# EAGLE design MainBoard (EAGLE 9.1.0)

## Sheet 1 of 3: Logic
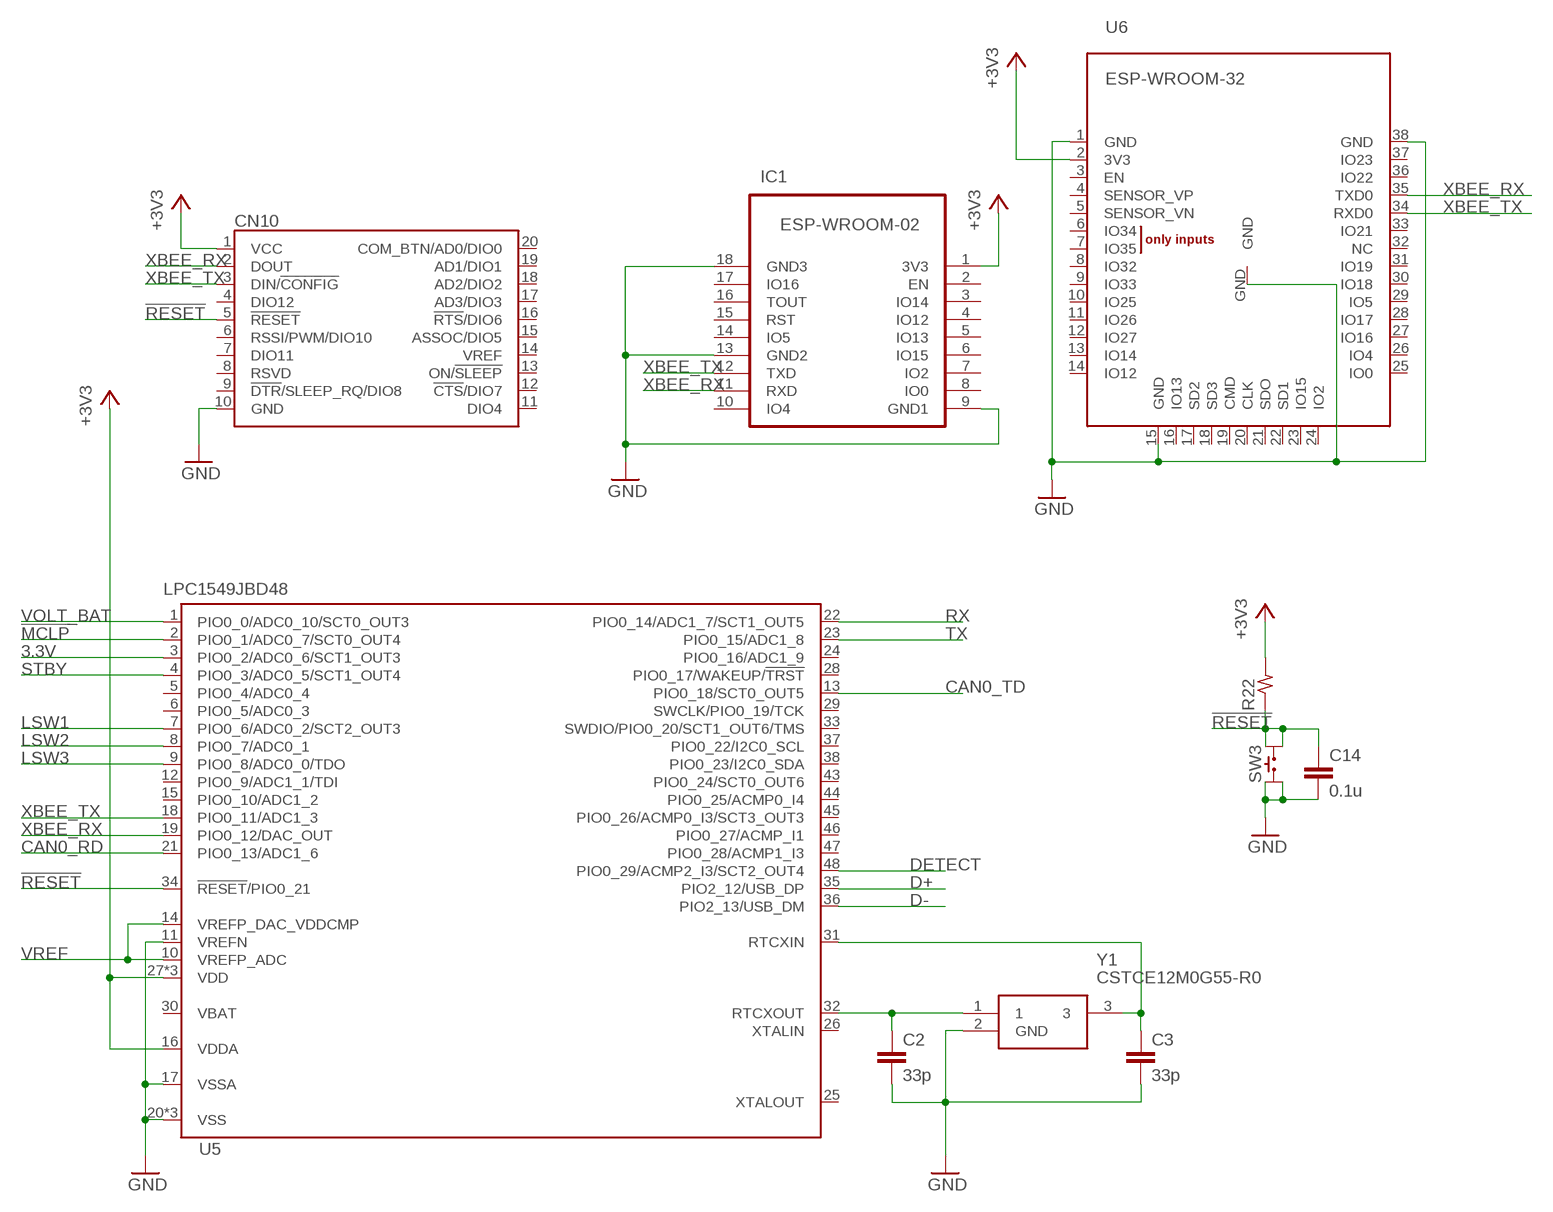
[diagram p0: schematic, sheet 1]

### Parts
C2  33p  C1608  [C1608]
C3  33p  C1608  [C1608]
C14  0.1u  C1608  [C1608]
CN10  XBEE-TH  [XBEE-TH]
IC1  ESP-WROOM-02  [ESP-WROOM-02]
R22  R1608  [R1608]
SW3  SKRP  [SKRP]
U5  LPC1549JBD48  [SOT313-2]
U6  ESP-WROOM-32  [ESP-WROOM-32]
Y1  CSTCE12M0G55-R0  [CSTCE12M0G55-R0]

### Nets
3.3V: U5.3(PIO0_2/ADC0_6/SCT1_OUT3)
!MCLP: U5.2(PIO0_1/ADC0_7/SCT0_OUT4) ; also sheet 3
!RESET: C14.1 CN10.5(!RESET) R22.1 SW3.B1 SW3.B2 U5.34(!RESET!/PIO0_21)
+3V3: CN10.1(VCC) IC1.1(3V3) R22.2 U5.16(VDDA) U5.27(VDD) U5.39(VDD) U5.42(VDD) U6.2(3V3) ; also sheet 2,3
CAN0_RD: U5.21(PIO0_13/ADC1_6) ; also sheet 3
CAN0_TD: U5.13(PIO0_18/SCT0_OUT5) ; also sheet 3
D+: U5.35(PIO2_12/USB_DP) ; also sheet 3
D-: U5.36(PIO2_13/USB_DM) ; also sheet 3
DETECT: U5.48(PIO0_29/ACMP2_I3/SCT2_OUT4) ; also sheet 3
GND: C2.2 C3.2 C14.2 CN10.10(GND) IC1.8(IO0) IC1.9(GND1) IC1.13(GND2) IC1.18(GND3) IC1.19(GND0) SW3.A1 SW3.A2 U5.11(VREFN) U5.17(VSSA) U5.20(VSS) U5.40(VSS) U5.41(VSS) U6.1(GND) U6.15(GND) U6.38(GND) U6.GND Y1.2(GND) ; also sheet 2,3
LSW1: U5.7(PIO0_6/ADC0_2/SCT2_OUT3) ; also sheet 2
LSW2: U5.8(PIO0_7/ADC0_1) ; also sheet 2
LSW3: U5.9(PIO0_8/ADC0_0/TDO) ; also sheet 2
N$17: C2.1 U5.32(RTCXOUT) Y1.1
N$27: C3.1 U5.31(RTCXIN) Y1.3
RX: U5.22(PIO0_14/ADC1_7/SCT1_OUT5)
STBY: U5.4(PIO0_3/ADC0_5/SCT1_OUT4) ; also sheet 3
TX: U5.23(PIO0_15/ADC1_8)
VOLT_BAT: U5.1(PIO0_0/ADC0_10/SCT0_OUT3) ; also sheet 2
VREF: U5.10(VREFP_ADC) U5.14(VREFP_DAC_VDDCMP) ; also sheet 2
XBEE_RX: CN10.2(DOUT) IC1.11(RXD) U5.19(PIO0_12/DAC_OUT) U6.35(TXD0)
XBEE_TX: CN10.3(DIN/!CONFIG) IC1.12(TXD) U5.18(PIO0_11/ADC1_3) U6.34(RXD0)
Unconnected: CN10.4(DIO12) CN10.6(RSSI/PWM/DIO10) CN10.7(DIO11) CN10.8(RSVD) CN10.9(!DTR!/SLEEP_RQ/DIO8) CN10.11(DIO4) CN10.12(!CTS!/DIO7) CN10.13(ON/!SLEEP) CN10.14(VREF) CN10.15(ASSOC/DIO5) CN10.16(!RTS!/DIO6) CN10.17(AD3/DIO3) CN10.18(AD2/DIO2) CN10.19(AD1/DIO1) CN10.20(COM_BTN/AD0/DIO0) IC1.2(EN) IC1.3(IO14) IC1.4(IO12) IC1.5(IO13) IC1.6(IO15) IC1.7(IO2) IC1.10(IO4) IC1.14(IO5) IC1.15(RST) IC1.16(TOUT) IC1.17(IO16) U5.5(PIO0_4/ADC0_4) U5.6(PIO0_5/ADC0_3) U5.12(PIO0_9/ADC1_1/TDI) U5.15(PIO0_10/ADC1_2) U5.24(PIO0_16/ADC1_9) U5.25(XTALOUT) U5.26(XTALIN) U5.28(PIO0_17/WAKEUP/!TRST) U5.29(SWCLK/PIO0_19/TCK) U5.33(SWDIO/PIO0_20/SCT1_OUT6/TMS) U5.37(PIO0_22/I2C0_SCL) U5.38(PIO0_23/I2C0_SDA) U5.43(PIO0_24/SCT0_OUT6) U5.44(PIO0_25/ACMP0_I4) U5.45(PIO0_26/ACMP0_I3/SCT3_OUT3) U5.46(PIO0_27/ACMP_I1) U5.47(PIO0_28/ACMP1_I3) U6.3(EN) U6.4(SENSOR_VP) U6.5(SENSOR_VN) U6.6(IO34) U6.7(IO35) U6.8(IO32) U6.9(IO33) U6.10(IO25) U6.11(IO26) U6.12(IO27) U6.13(IO14) U6.14(IO12) U6.16(IO13) U6.17(SD2) U6.18(SD3) U6.19(CMD) U6.20(CLK) U6.21(SDO) U6.22(SD1) U6.23(IO15) U6.24(IO2) U6.25(IO0) U6.26(IO4) U6.27(IO16) U6.28(IO17) U6.29(IO5) U6.30(IO18) U6.31(IO19) U6.32(NC) U6.33(IO21) U6.36(IO22) U6.37(IO23)

## Sheet 2 of 3: Power
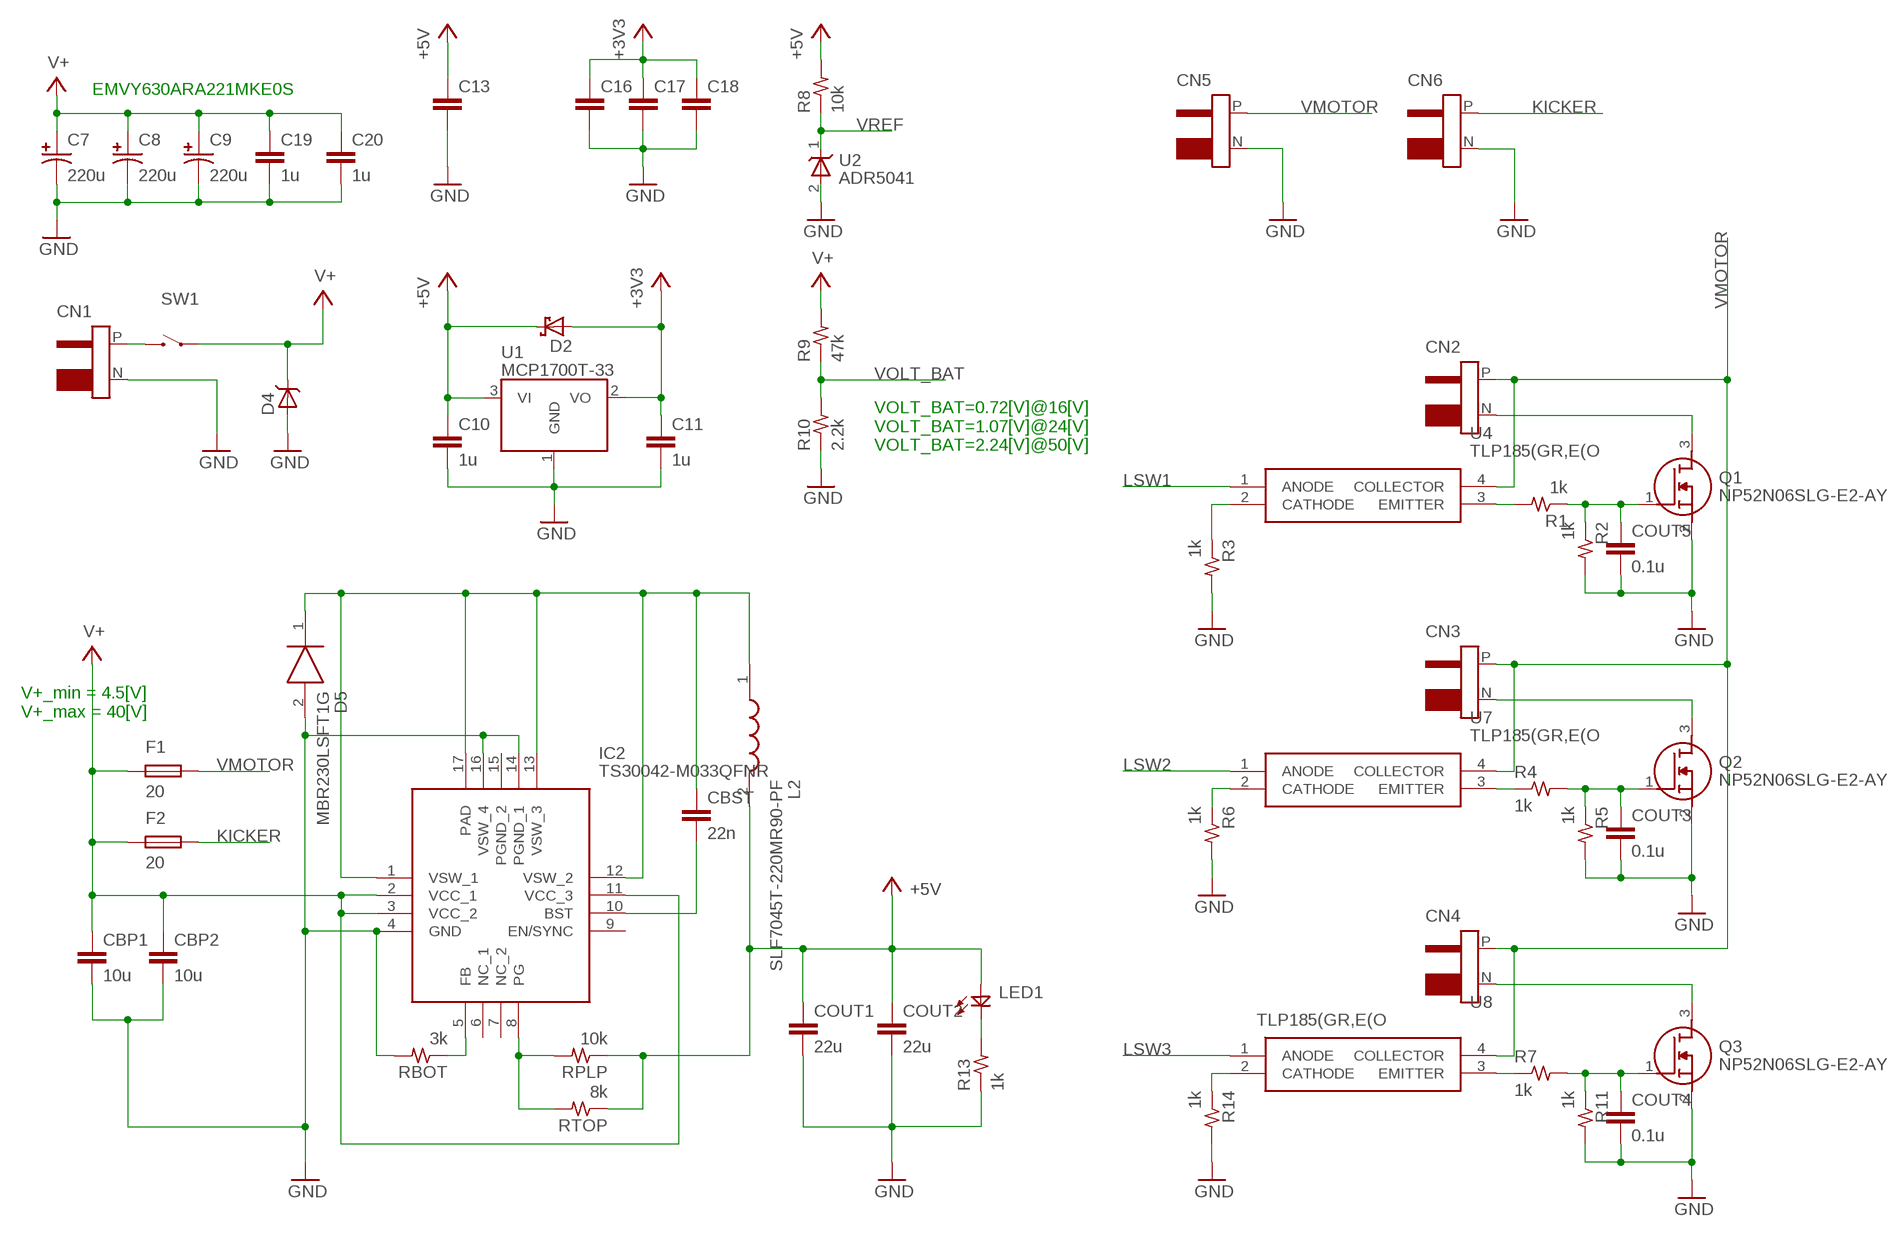
[diagram p1: schematic, sheet 2]

### Parts
C7  220u  CPOLS-12.5  [ES-12.5]
C8  220u  CPOLS-12.5  [ES-12.5]
C9  220u  CPOLS-12.5  [ES-12.5]
C10  1u  C1608  [C1608]
C11  1u  C1608  [C1608]
C13  C1608  [C1608]
C16  C1608  [C1608]
C17  C1608  [C1608]
C18  C1608  [C1608]
C19  1u  C2012  [C2012]
C20  1u  C2012  [C2012]
CBP1  10u  C1608  [C1608]
CBP2  10u  C1608  [C1608]
CBST  22n  C1608  [C1608]
CN1  T-CON  [T-CON]
CN2  T-CON  [T-CON]
CN3  T-CON  [T-CON]
CN4  T-CON  [T-CON]
CN5  T-CON  [T-CON]
CN6  T-CON  [T-CON]
COUT1  22u  C1608  [C1608]
COUT2  22u  C1608  [C1608]
COUT3  0.1u  C1608  [C1608]
COUT4  0.1u  C1608  [C1608]
COUT5  0.1u  C1608  [C1608]
D2  SBD-1608  [DIODE_1608]
D4  ZENER-DO-214AC  [DO-214AC]
D5  MBR230LSFT1G  [SODFL3616X98N]
F1  20  F3216  [3216]
F2  20  F3216  [3216]
IC2  TS30042-M033QFNR  [QFN50P300X300X100-17N]
L2  SLF7045T-220MR90-PF  [INDPM7070X480N]
LED1  LED1608  [LED1608]
Q1  NP52N06SLG-E2-AY  [NP52N06SLGE2AY]
Q2  NP52N06SLG-E2-AY  [NP52N06SLGE2AY]
Q3  NP52N06SLG-E2-AY  [NP52N06SLGE2AY]
R1  1k  R1608  [R1608]
R2  1k  R1608  [R1608]
R3  1k  R1608  [R1608]
R4  1k  R1608  [R1608]
R5  1k  R1608  [R1608]
R6  1k  R1608  [R1608]
R7  1k  R1608  [R1608]
R8  10k  R1608  [R1608]
R9  47k  R1608  [R1608]
R10  2.2k  R1608  [R1608]
R11  1k  R1608  [R1608]
R13  1k  R1608  [R1608]
R14  1k  R1608  [R1608]
RBOT  3k  R1608  [R1608]
RPLP  10k  R1608  [R1608]
RTOP  8k  R1608  [R1608]
SW1  SLE6A4  [SLE6_10A4]
U1  MCP1700T-33  [SOT23-3]
U2  ADR5041  [SC70-3]
U4  TLP185(GR,E(O  [SOP254P700X220-4N]
U7  TLP185(GR,E(O  [SOP254P700X220-4N]
U8  TLP185(GR,E(O  [SOP254P700X220-4N]

### Nets
+3V3: C11.1 C16.1 C17.1 C18.1 D2.A U1.2(VO) ; also sheet 1,3
+5V: C10.1 C13.1 COUT1.1 COUT2.1 D2.K L2.2 LED1.A R8.2 RPLP.1 RTOP.1 U1.3(VI) ; also sheet 3
GND: C7.N C8.N C9.N C10.2 C11.2 C13.2 C16.2 C17.2 C18.2 C19.2 C20.2 CBP1.2 CBP2.2 CN1.N CN5.N CN6.N COUT1.2 COUT2.2 COUT3.2 COUT4.2 COUT5.2 D4.A D5.2(A) IC2.4(GND) IC2.14(PGND_1) IC2.16(VSW_4) Q1.2(S) Q2.2(S) Q3.2(S) R2.2 R3.2 R5.2 R6.2 R10.1 R11.2 R13.1 R14.2 RBOT.2 U1.1(GND) U2.2(A) ; also sheet 1,3
KICKER: CN6.P F2.2
LSW1: U4.1(ANODE) ; also sheet 1
LSW2: U7.1(ANODE) ; also sheet 1
LSW3: U8.1(ANODE) ; also sheet 1
N$1: CN2.N Q1.3(D)
N$2: R1.2 U4.3(EMITTER)
N$3: COUT5.1 Q1.1(G) R1.1 R2.1
N$5: CN3.N Q2.3(D)
N$6: R3.1 U4.2(CATHODE)
N$7: R6.1 U7.2(CATHODE)
N$8: R4.1 U7.3(EMITTER)
N$9: CN4.N Q3.3(D)
N$10: CN1.P SW1.1(B)
N$16: CBST.1 D5.1(K) IC2.1(VSW_1) IC2.12(VSW_2) IC2.13(VSW_3) IC2.17(PAD) L2.1
N$19: COUT3.1 Q2.1(G) R4.2 R5.1
N$20: LED1.K R13.2
N$21: IC2.5(FB) RBOT.1
N$22: IC2.8(PG) RPLP.2 RTOP.2
N$24: CBST.2 IC2.10(BST)
N$25: R14.1 U8.2(CATHODE)
N$26: R7.1 U8.3(EMITTER)
N$28: COUT4.1 Q3.1(G) R7.2 R11.1
V+: C7.P C8.P C9.P C19.1 C20.1 CBP1.1 CBP2.1 D4.K F1.1 F2.1 IC2.2(VCC_1) IC2.3(VCC_2) IC2.11(VCC_3) R9.2 SW1.P(A)
VMOTOR: CN2.P CN3.P CN4.P CN5.P F1.2 U4.4(COLLECTOR) U7.4(COLLECTOR) U8.4(COLLECTOR)
VOLT_BAT: R9.1 R10.2 ; also sheet 1
VREF: R8.1 U2.1(K) ; also sheet 1
Unconnected: IC2.6(NC_1) IC2.7(NC_2) IC2.9(EN/SYNC) IC2.15(PGND_2)

### Notes on the sheet
- EMVY630ARA221MKE0S
- VOLT_BAT=0.72[V]@16[V]
  VOLT_BAT=1.07[V]@24[V]
  VOLT_BAT=2.24[V]@50[V]
- V+_min = 4.5[V]
  V+_max = 40[V]

## Sheet 3 of 3: Conectivity
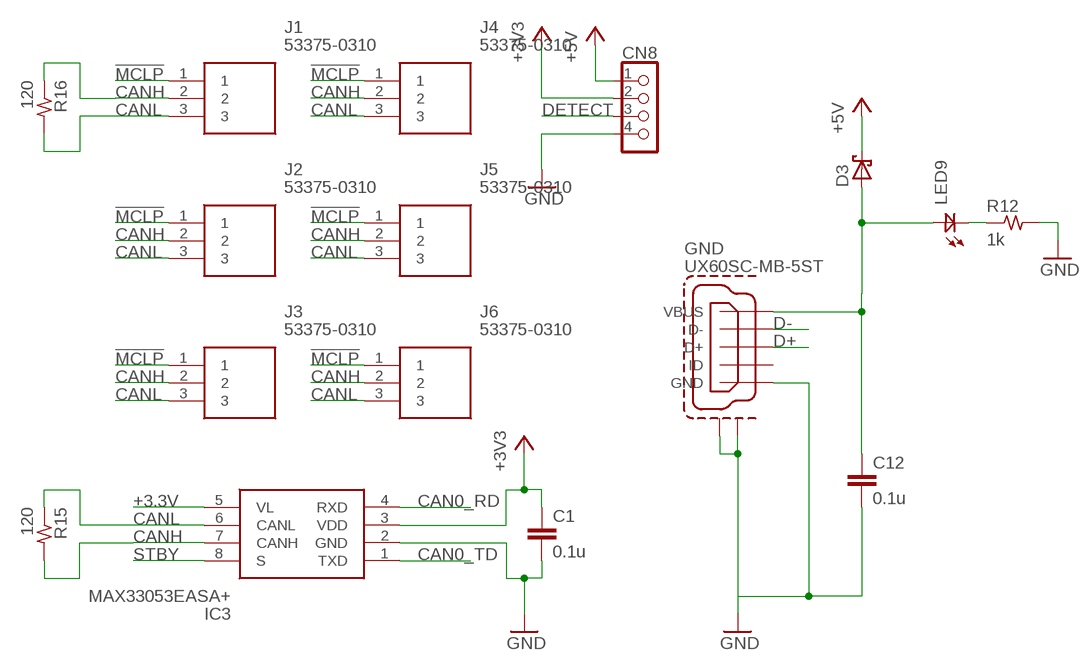
[diagram p2: schematic, sheet 3]

### Parts
C1  0.1u  C1608  [C1608]
C12  0.1u  C1608  [C1608]
CN8  53375-0410  [53375-04]
D3  SBD-1608  [1608]
GND  UX60SC-MB-5ST  [UX60SC-MB-5ST]
IC3  MAX33053EASA+  [SOIC127P605X145-8N]
J1  53375-0310  [53375-0310]
J2  53375-0310  [53375-0310]
J3  53375-0310  [53375-0310]
J4  53375-0310  [53375-0310]
J5  53375-0310  [53375-0310]
J6  53375-0310  [53375-0310]
LED9  LED1608  [LED1608]
R12  1k  R1608  [R1608]
R15  120  R1608  [R1608]
R16  120  R1608  [R1608]

### Nets
!MCLP: J1.1 J2.1 J3.1 J4.1 J5.1 J6.1 ; also sheet 1
+3.3V: IC3.5(VL)
+3V3: CN8.2 ; also sheet 1,2
+5V: CN8.1 D3.K ; also sheet 2
CAN0_RD: IC3.4(RXD) ; also sheet 1
CAN0_TD: IC3.1(TXD) ; also sheet 1
CANH: IC3.7(CANH) J1.2 J2.2 J3.2 J4.2 J5.2 J6.2 R15.2 R16.1
CANL: IC3.6(CANL) J1.3 J2.3 J3.3 J4.3 J5.3 J6.3 R15.1 R16.2
D+: GND.3(D+) ; also sheet 1
D-: GND.2(D-) ; also sheet 1
DETECT: CN8.3 ; also sheet 1
GND: C1.2 C12.2 CN8.4 GND.5(GND) GND.S1 GND.S2 IC3.2(GND) R12.2 ; also sheet 1,2
N$13: C12.1 D3.A GND.1(VBUS) LED9.A
N$18: LED9.K R12.1
N$23: C1.1 IC3.3(VDD) ; supply symbol labelled +3V3
STBY: IC3.8(S) ; also sheet 1
Unconnected: GND.4(ID)

## Power pins joined to a net without a drawn wire
VBAT: U5.30(VBAT)

## Library data of the parts
C1-C3 C10-C14 C16-C20 CBP1 CBP2 CBST COUT1-COUT5 = MotorDriver:C
C7-C9 = Passive:CPOL
CN1-CN6 = Connector:T-CON
CN8 = MotorDriver:53375-0410
CN10 = Connector:XBEE-*
D2 = MotorDriver:SBD-*
D3 = Diode:SBD-*
D4 = Diode:ZENER-*
D5 = MBR230LSFT1G:MBR230LSFT1G: Diode Schottky 30V 2A SOD123FL ON Semiconductor MBR230LSFT1G Schottky Diode, 2A, 30V, 2-Pin SOD-123FL Source: Datasheet <http://www.onsemi.com/pub/Collateral/MBR230LSFT1-D.PDF>; ALLIED_NUMBER: 70300366; ALLIED_PRICE-STOCK: http://www.alliedelec.com/on-semiconductor-mbr230lsft1g/70300366/; ARROW_PART_NUMBER: MBR230LSFT1G; ARROW_PRICE-STOCK: https://www.arrow.com/en/products/mbr230lsft1g/on-semiconductor; DESCRIPTION: Diode Schottky 30V 2A SOD123FL ON Semiconductor MBR230LSFT1G Schottky Diode, 2A, 30V, 2-Pin SOD-123FL; HEIGHT: 0.98mm; MANUFACTURER_NAME: ON Semiconductor; MANUFACTURER_PART_NUMBER: MBR230LSFT1G; RS_PART_NUMBER: 1630931; RS_PRICE-STOCK: http://uk.rs-online.com/web/p/products/1630931
F1 F2 = Passive:F
GND = con-Hirose:UX60S
IC1 = esp-wroom-02:ESP-WROOM-02: WiFi module - ESP-WROOM-02
IC2 = TS30042-M033QFNR:TS30042-M033QFNR: Switching Voltage Regulators 2A 3.3V Current-Mode Sync. Buck Converter Source: Datasheet <http://www.semtech.com/images/datasheet/ts3004x.pdf>; ARROW_PART_NUMBER: TS30042-M033QFNR; ARROW_PRICE-STOCK: https://www.arrow.com/en/products/ts30042-m033qfnr/semtech; DESCRIPTION: Switching Voltage Regulators 2A 3.3V Current-Mode Sync. Buck Converter; HEIGHT: 1mm; MANUFACTURER_NAME: SEMTECH; MANUFACTURER_PART_NUMBER: TS30042-M033QFNR
IC3 = MAX33053EASA+:MAX33053EASA+: MAXIM INTEGRATED PRODUCTS - MAX33053EASA+ - CAN TRANSCEIVER, 2MBPS, -40 TO 125DEG C Source: Datasheet <https://componentsearchengine.com/Datasheets/2/MAX33053EASA .pdf>; DESCRIPTION: MAXIM INTEGRATED PRODUCTS - MAX33053EASA+ - CAN TRANSCEIVER, 2MBPS, -40 TO 125DEG C; HEIGHT: 1.448mm; MANUFACTURER_NAME: Maxim Integrated; MANUFACTURER_PART_NUMBER: MAX33053EASA+
J1 = 53375-0310:53375-0310: Molex MINI-LOCK Series, Series Number 53375, 2.5mm Pitch 3 Way 1 Row Straight PCB Header, Solder Termination, 3A Source: Datasheet <http://docs-europe.electrocomponents.com/webdocs/150e/0900766b8150ead2.pdf>; ARROW_PART_NUMBER: 53375-0310; ARROW_PRICE-STOCK: http://uk.rs-online.com/web/p/products/7206407P; DESCRIPTION: Molex MINI-LOCK Series, Series Number 53375, 2.5mm Pitch 3 Way 1 Row Straight PCB Header, Solder Termination, 3A; HEIGHT: mm; MANUFACTURER_NAME: Molex; MANUFACTURER_PART_NUMBER: 53375-0310; RS_PART_NUMBER: 7206407P; RS_PRICE-STOCK: http://uk.rs-online.com/web/p/products/7206407P; SPICEPREFIX: X
J2-J6 = 53375-0310:53375-0310: Molex MINI-LOCK Series, Series Number 53375, 2.5mm Pitch 3 Way 1 Row Straight PCB Header, Solder Termination, 3A Source: Datasheet <http://docs-europe.electrocomponents.com/webdocs/150e/0900766b8150ead2.pdf>; ARROW_PART_NUMBER: 53375-0310; ARROW_PRICE-STOCK: http://uk.rs-online.com/web/p/products/7206407P; DESCRIPTION: Molex MINI-LOCK Series, Series Number 53375, 2.5mm Pitch 3 Way 1 Row Straight PCB Header, Solder Termination, 3A; HEIGHT: mm; MANUFACTURER_NAME: Molex; MANUFACTURER_PART_NUMBER: 53375-0310; RS_PART_NUMBER: 7206407P; RS_PRICE-STOCK: http://uk.rs-online.com/web/p/products/7206407P
L2 = SLF7045T-220MR90-PF:SLF7045T-220MR90-PF: SMD Shielded Inductor, 22uH, R073, 900mA TDK SLF Series Shielded Wire-wound SMD Inductor with a Ferrite Core, 22 H Wire-Wound 1.34A Idc Source: Datasheet <http://docs-europe.electrocomponents.com/webdocs/1538/0900766b81538c22.pdf>; ARROW_PART_NUMBER: SLF7045T-220MR90-PF; ARROW_PRICE-STOCK: https://www.arrow.com/en/products/slf7045t-220mr90-pf/tdk; DESCRIPTION: SMD Shielded Inductor, 22uH, R073, 900mA TDK SLF Series Shielded Wire-wound SMD Inductor with a Ferrite Core, 22 H Wire-Wound 1.34A Idc; HEIGHT: 4.8mm; MANUFACTURER_NAME: TDK; MANUFACTURER_PART_NUMBER: SLF7045T-220MR90-PF; RS_PART_NUMBER: 9164248P; RS_PRICE-STOCK: http://uk.rs-online.com/web/p/products/9164248P
LED1 LED9 = MotorDriver:LED
Q1-Q3 = NP52N06SLG-E2-AY:NP52N06SLG-E2-AY: SWITCHING N-CHANNEL POWER MOS FET Source: Datasheet <http://akizukidenshi.com/download/ds/renesas/NP52N06SLG.pdf>; ARROW_PART_NUMBER: NP52N06SLG-E2-AY; DESCRIPTION: SWITCHING N-CHANNEL POWER MOS FET; HEIGHT: 2mm; MANUFACTURER_NAME: Renesas Electronics; MANUFACTURER_PART_NUMBER: NP52N06SLG-E2-AY
R1-R16 R22 RBOT RPLP RTOP = MotorDriver:R
SW1 = Switch:SLE*A4
SW3 = MotorDriver:SKRP
U1 = MotorDriver:MCP1700T-*
U2 = MotorDriver:ADR504*
U4 U7 U8 = TLP185(GR_E(O:TLP185(GR,E(O: Toshiba TLP185(GR,E(O DC Input Transistor Output Optocoupler, Surface Mount, 4-Pin SO Source: Datasheet <https://toshiba.semicon-storage.com/info/docget.jsp?did=11791&prodName=TLP185>; ARROW_PART_NUMBER: TLP185(GR,E(O; ARROW_PRICE-STOCK: http://uk.rs-online.com/web/p/products/1732829; DESCRIPTION: Toshiba TLP185(GR,E(O DC Input Transistor Output Optocoupler, Surface Mount, 4-Pin SO; HEIGHT: 2.2mm; MANUFACTURER_NAME: Toshiba; MANUFACTURER_PART_NUMBER: TLP185(GR,E(O; RS_PART_NUMBER: 1732829; RS_PRICE-STOCK: http://uk.rs-online.com/web/p/products/1732829
U5 = NXP_60_26022015:LPC1549JBD48: 32-bit ARM Cortex-M3 microcontroller; up to 256 kB flash and 36 kB SRAM; FS USB, CAN, RTC, SPI, USART, I2C The LPC15xx are ARM Cortex-M3 based microcontrollers for embedded applications featuring a rich peripheral set with very low power consumption. The ARM Cortex-M3 is a next generation core that offers system enhancements such as enhanced debug features and a higher level of support block integration. The LPC15xx operate at CPU frequencies of up to 72 MHz. The ARM Cortex-M3 CPU incorporates a 3-stage pipeline and uses a Harvard architecture with separate local instruction and data buses as well as a third bus for peripherals. The ARM Cortex-M3 CPU also includes an internal prefetch unit that supports speculative branching. The LPC15xx includes up to 256 kB of flash memory, 32 kB of ROM, a 4 kB EEPROM, and up to 36 kB of SRAM. The peripheral compliment includes one full-speed USB 2.0 device, two SPI interfaces, three USARTs, one Fast-mode Plus I2C-bus interface, one C_CAN module, PWM/timer subsystem with four configurable, multi-purpose State Configurable Timers (SCTimer/PWM) with input pre-processing unit, a Real-time clock module with independent power supply and a dedicated oscillator, two 12-channel/12-bit, 2 Msamples/s ADCs, one 12-bit, 500 kSamples/s DAC, four voltage comparators with internal voltage reference, and a temperature sensor. A DMA engine can service most peripherals. AAL Eindhoven MK; CHANNELS: 9/7; FLASH: 256k; GPIO: 30; SRAM: 36k; USB: yes
U6 = esp32:ESP-WROOM-32
Y1 = CSTCE12M0G55-R0:CSTCE12M0G55-R0: SMT ceramic resonator 12.0MHz CSTCE12M0G55-R0, Ceramic Resonator, 12MHz Fundamental 33pF, 3-Pin Cap Chip, 3.2 x 1.3 x 0.7mm Source: Datasheet <https://componentsearchengine.com/Datasheets/1/CSTCE12M0G55-R0.pdf>; ARROW_PART_NUMBER: CSTCE12M0G55-R0; ARROW_PRICE-STOCK: https://www.arrow.com/en/products/cstce12m0g55-r0/murata-manufacturing; DESCRIPTION: SMT ceramic resonator 12.0MHz CSTCE12M0G55-R0, Ceramic Resonator, 12MHz Fundamental 33pF, 3-Pin Cap Chip, 3.2 x 1.3 x 0.7mm; HEIGHT: mm; MANUFACTURER_NAME: Murata Electronics; MANUFACTURER_PART_NUMBER: CSTCE12M0G55-R0; RS_PART_NUMBER: 7214809P; RS_PRICE-STOCK: http://uk.rs-online.com/web/p/products/7214809P

## Board
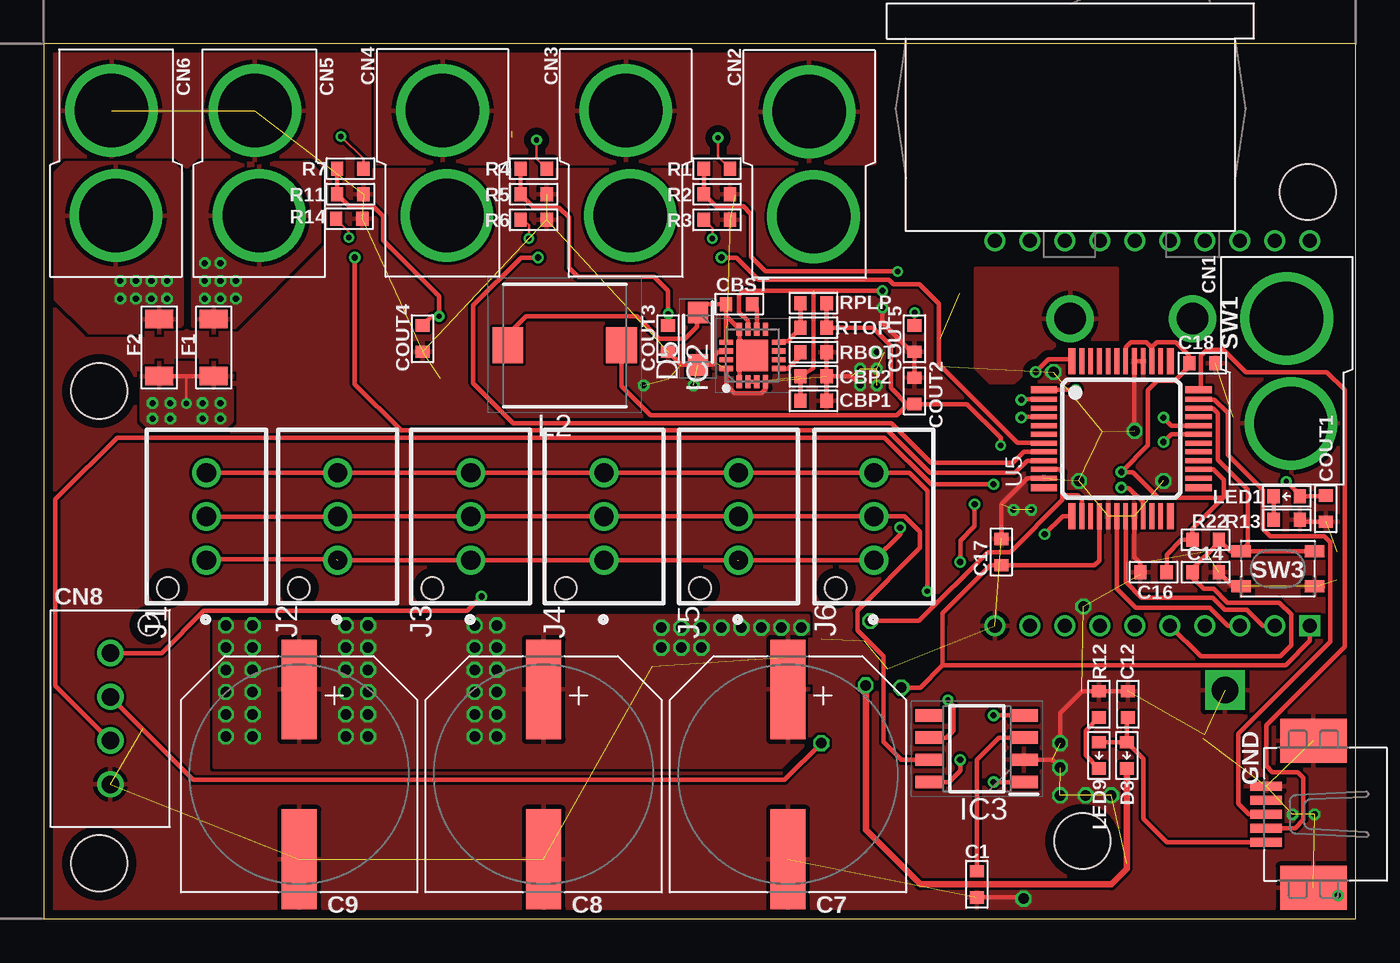
[diagram p3: board, top side]
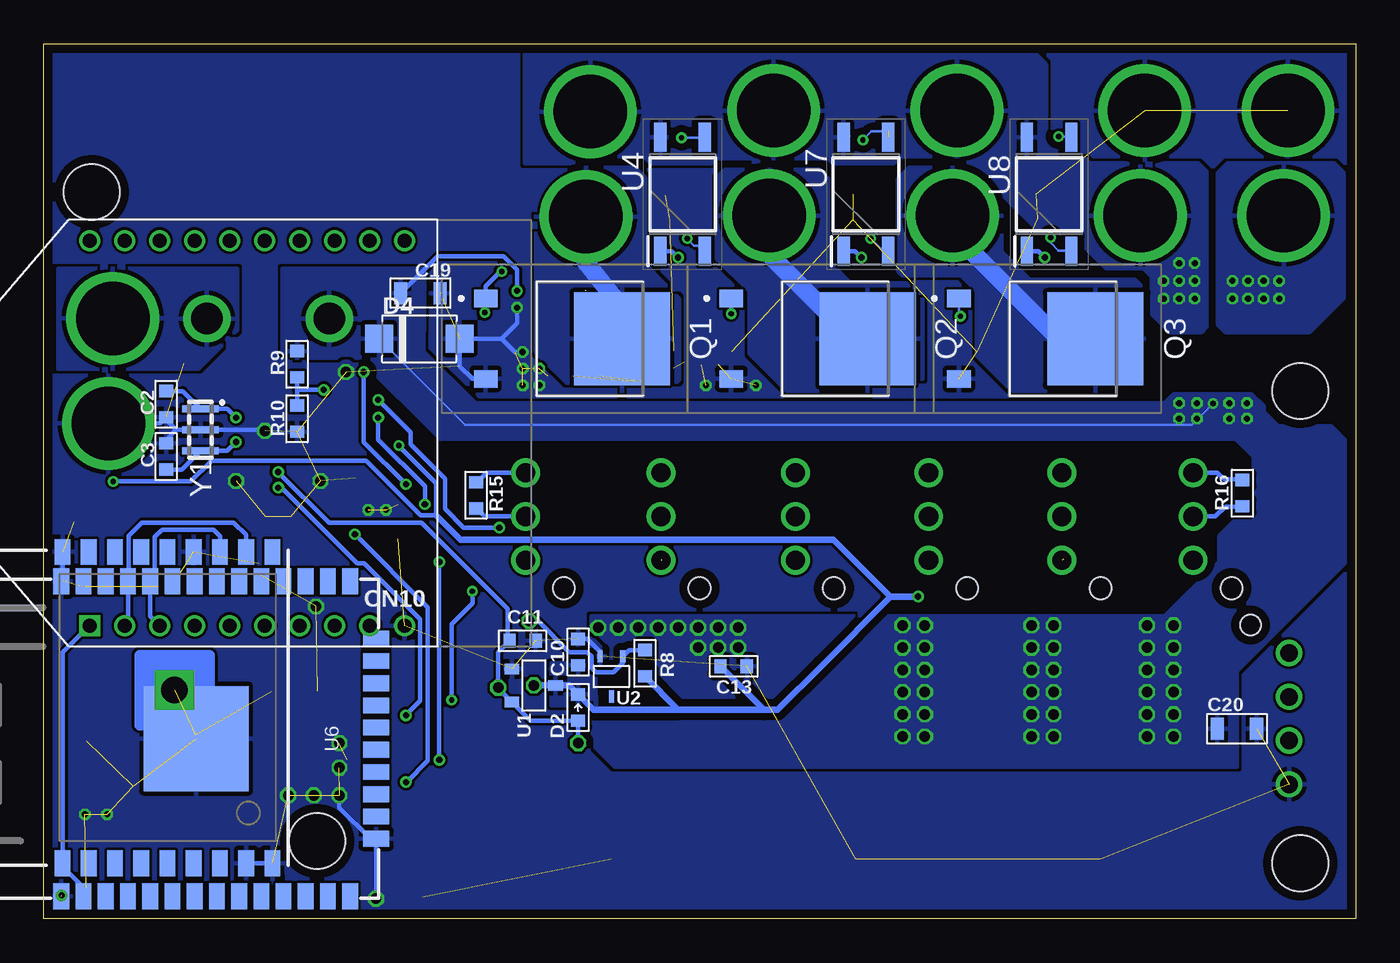
[diagram p4: board, bottom side, seen from below]

Size 75 x 50 mm. Coordinates in mm from the lower left corner, seen from the top.
Outline: 0,0 75,0 75,50 0,50 0,0
Copper layers (1*16): Top 0.035mm / dielectric 1.6mm / Bottom 0.035mm
Design rules "Elecrow_2-layer_PCB_eagle_rule": minimum track width 6mil, minimum drill 12mil, track to track 6mil, track to pad 6mil, pad to pad 6mil, via to via 8mil, smd to smd 0mil, copper to edge 20mil, drill to drill 10mil, minimum pad ring 6mil, minimum via ring 6mil, stop-mask expansion 0mil, vias tented up to drill 100mil, thermal gap 10mil
Holes 3.2 mm at 3.17,30.16 3.17,3.17 72.26,41.53 59.37,4.45

### Footprints (pad centres in the part's own frame; a part is rotated, then mirrored left to right if it is on the bottom)
C1608 = smd 0.7 x 0.8: 1 -0.75,0; 2 0.75,0
ES-12.5 = smd 5.7 x 2: N 4.85,0; P -4.85,0
C2012 = smd 0.75 x 1.25: 1 -1.125,0; 2 1.125,0
T-CON = drill 4.2 pad 5.3: N -3,-0.25; P 3,0
53375-04 = drill 1 pad 1.5: 1 3.75,0; 2 1.25,0; 3 -1.25,0; 4 -3.75,0 | hole 1.2: 5.35,-2.2
XBEE-TH = drill 0.8 square: 1 -11,9 | drill 0.8: 2 -11,7; 3 -11,5; 4 -11,3; 5 -11,1; 6 -11,-1; 7 -11,-3; 8 -11,-5; 9 -11,-7; 10 -11,-9; 11 11,-9; 12 11,-7; 13 11,-5; 14 11,-3; 15 11,-1; 16 11,1; 17 11,3; 18 11,5; 19 11,7; 20 11,9
DIODE_1608 = smd 0.7 x 0.8: A 0.75,0; K -0.75,0
1608 = smd 0.7 x 0.8: A 0.75,0; K -0.75,0
DO-214AC = smd 1.6 x 1.6: A 2.3,0; K -2.3,0
SODFL3616X98N = smd 1.24 x 1.12: 1 -1.5,0; 2 1.5,0
3216 = smd 1.05 x 1.6: 1 -1.625,0; 2 1.625,0
UX60SC-MB-5ST = smd 1.8 x 0.5: 1 2.7,1.6; 2 2.7,0.8; 3 2.7,0; 4 2.7,-0.8; 5 2.7,-1.6 | smd 3.8 x 2.5: S1 0,-4.2; S2 0,4.2
ESP-WROOM-02 = smd 1.485 x 0.9: 1 -8.893,4.9; 2 -8.893,3.4; 3 -8.893,1.9; 4 -8.893,0.4; 5 -8.893,-1.1; 6 -8.893,-2.6; 7 -8.893,-4.1; 8 -8.893,-5.6; 9 -8.893,-7.1; 10 8.893,-7.1; 11 8.893,-5.6; 12 8.893,-4.1; 13 8.893,-2.6; 14 8.893,-1.1; 15 8.893,0.4; 16 8.893,1.9; 17 8.893,3.4; 18 8.893,4.9 | drill 1.5 pad 2 square: 19 1,-1.5
QFN50P300X300X100-17N = smd 0.75 x 0.3: 1 -1.5,0.75; 2 -1.5,0.25; 3 -1.5,-0.25; 4 -1.5,-0.75; 9 1.5,-0.75; 10 1.5,-0.25; 11 1.5,0.25; 12 1.5,0.75 | smd 0.3 x 0.75: 5 -0.75,-1.5; 6 -0.25,-1.5; 7 0.25,-1.5; 8 0.75,-1.5; 13 0.75,1.5; 14 0.25,1.5; 15 -0.25,1.5; 16 -0.75,1.5 | smd 1.8 x 1.8: 17 0,0
SOIC127P605X145-8N = smd 1.6 x 0.7: 1 -2.7,1.905; 2 -2.7,0.635; 3 -2.7,-0.635; 4 -2.7,-1.905; 5 2.7,-1.905; 6 2.7,-0.635; 7 2.7,0.635; 8 2.7,1.905
53375-0310 = drill 1.1 pad 1.65: 1 2.5,-3.4; 2 0,-3.4; 3 -2.5,-3.4 | hole 1.25: 4.1,-5.6
INDPM7070X480N = smd 1.75 x 2.05: 1 -3.25,0; 2 3.25,0
LED1608 = smd 0.7 x 0.8: A 0.75,0; K -0.75,0
NP52N06SLGE2AY = smd 1.35 x 1: 1 -4.525,2.3; 2 -4.525,-2.3 | smd 5.5 x 5.3: 3 3.275,0
R1608 = smd 0.7 x 0.8: 1 -0.75,0; 2 0.75,0
SLE6_10A4 = drill 1.8 pad 2.6: 1 0,7; P 0,0
SKRP = smd 1.1 x 0.7: A1 -2.1,-1; A2 2.1,-1; B1 -2.1,1; B2 2.1,1
SOT23-3 = smd 0.6 x 0.85: 1 -0.95,-1.25; 2 0.95,-1.25; 3 0,1.25
SC70-3 = smd 0.3 x 0.7: 1 -0.65,-1.15; 2 0.65,-1.15; 3 0,1.15
SOP254P700X220-4N = smd 1.65 x 0.7: 1 -3.25,1.27; 2 -3.25,-1.27; 3 3.25,-1.27; 4 3.25,1.27
SOT313-2 = smd 0.4 x 1.5: 1 -2.81,-4.425; 12 2.81,-4.425; 25 2.81,4.425; 36 -2.81,4.425 | smd 0.28 x 1.5: 2 -2.25,-4.425; 3 -1.75,-4.425; 4 -1.25,-4.425; 5 -0.75,-4.425; 6 -0.25,-4.425; 7 0.25,-4.425; 8 0.75,-4.425; 9 1.25,-4.425; 10 1.75,-4.425; 11 2.25,-4.425; 26 2.25,4.425; 27 1.75,4.425; 28 1.25,4.425; 29 0.75,4.425; 30 0.25,4.425; 31 -0.25,4.425; 32 -0.75,4.425; 33 -1.25,4.425; 34 -1.75,4.425; 35 -2.25,4.425 | smd 1.5 x 0.4: 13 4.425,-2.81; 24 4.425,2.81; 37 -4.425,2.81; 48 -4.425,-2.81 | smd 1.5 x 0.28: 14 4.425,-2.25; 15 4.425,-1.75; 16 4.425,-1.25; 17 4.425,-0.75; 18 4.425,-0.25; 19 4.425,0.25; 20 4.425,0.75; 21 4.425,1.25; 22 4.425,1.75; 23 4.425,2.25; 38 -4.425,2.25; 39 -4.425,1.75; 40 -4.425,1.25; 41 -4.425,0.75; 42 -4.425,0.25; 43 -4.425,-0.25; 44 -4.425,-0.75; 45 -4.425,-1.25; 46 -4.425,-1.75; 47 -4.425,-2.25
ESP-WROOM-32 = smd 0.9 x 1.5: 1 7.7,9; 2 6.43,9; 3 5.16,9; 4 3.89,9; 5 2.62,9; 6 1.35,9; 7 0.08,9; 8 -1.19,9; 9 -2.46,9; 10 -3.73,9; 11 -5,9; 12 -6.27,9; 13 -7.54,9; 14 -8.81,9; 25 -8.81,-9; 26 -7.54,-9; 27 -6.27,-9; 28 -5,-9; 29 -3.73,-9; 30 -2.46,-9; 31 -1.19,-9; 32 0.08,-9; 33 1.35,-9; 34 2.62,-9; 35 3.89,-9; 36 5.16,-9; 37 6.43,-9; 38 7.7,-9 | smd 1.5 x 0.9: 15 -10.3,5.715; 16 -10.3,4.445; 17 -10.3,3.175; 18 -10.3,1.905; 19 -10.3,0.635; 20 -10.3,-0.635; 21 -10.3,-1.905; 22 -10.3,-3.175; 23 -10.3,-4.445; 24 -10.3,-5.715 | smd 6 x 6: GND 0,0
CSTCE12M0G55-R0 = smd 0.4 x 2.1: 1 -1.2,0; 2 0,0; 3 1.2,0

### Placement (x,y rotation side)
C1  53.34,1.97 270 top
C2  68.01,29.4 270 bottom
C3  68.01,26.42 90 bottom
C7  42.55,8.26 270 top
C8  28.57,8.26 270 top
C9  14.61,8.26 270 top
C10  44.45,15.24 90 bottom
C11  47.62,15.88 0 bottom
C12  61.98,12.26 90 top
C13  35.56,14.41 0 bottom
C14  66.42,19.81 0 top
C16  63.44,19.81 180 top
C17  54.74,20.95 90 top
C18  66.23,31.75 0 top
C19  53.47,35.75 0 bottom
C20  6.79,10.86 0 bottom
CBP1  44.01,29.59 0 top
CBP2  44.01,30.99 0 top
CBST  39.75,35.12 0 top
CN1  71.06,31.31 90 top
CN2  43.75,43.12 90 top
CN3  33.27,43.18 90 top
CN4  22.8,43.18 90 top
CN5  12.32,43.18 270 top
CN6  4.13,43.18 270 top
CN8  3.81,11.43 90 top
CN10  63.37,27.75 90 bottom
COUT1  73.28,23.43 270 top
COUT2  49.78,30.16 90 top
COUT3  35.69,33.15 270 top
COUT4  21.65,33.15 270 top
COUT5  49.78,33.15 270 top
D2  44.45,12.06 270 bottom
D3  61.91,9.33 90 top
D4  53.53,33.15 0 bottom
D5  37.4,33.15 270 top
F1  9.72,32.64 90 top
F2  6.6,32.64 90 top
GND  72.58,5.97 180 top
IC1  69.02,12.06 90 bottom
IC2  40.51,32.19 90 top
IC3  53.34,9.72 180 top
J1  12.7,22.99 270 top
J2  20.19,22.99 270 top
J3  27.81,22.99 270 top
J4  35.43,22.99 270 top
J5  43.12,22.99 270 top
J6  50.86,22.99 270 top
L2  29.78,32.77 0 top
LED1  71.06,24.13 0 top
LED9  60.33,9.33 90 top
Q1  45.21,33.15 0 bottom
Q2  31.18,33.15 0 bottom
Q3  18.16,33.15 0 bottom
R1  38.48,42.86 0 top
R2  38.48,41.4 0 top
R3  38.48,39.94 0 top
R4  28,42.86 180 top
R5  28,41.4 0 top
R6  28,39.94 0 top
R7  17.53,42.86 180 top
R8  40.64,14.61 270 bottom
R9  60.52,31.69 90 bottom
R10  60.52,28.57 90 bottom
R11  17.53,41.4 0 top
R12  60.33,12.26 90 top
R13  71.06,22.8 180 top
R14  17.46,40.01 0 top
R15  50.29,24.19 270 bottom
R16  6.48,24.32 90 bottom
R22  66.42,21.65 180 top
RBOT  44.01,32.38 0 top
RPLP  44.01,35.18 180 top
RTOP  44.01,33.78 180 top
SW1  58.67,34.29 270 top
SW3  70.55,20 0 top
U1  46.99,13.34 270 bottom
U2  42.55,13.84 180 bottom
U4  38.48,41.4 90 bottom
U5  61.59,27.43 270 top
U6  66.29,10.29 180 bottom
U7  28,41.4 90 bottom
U8  17.53,41.4 90 bottom
Y1  66.04,27.94 270 bottom

### Tracks (layer width: path | path; a pad name or v marks a point on that pad's centre or on a via)
!MCLP  (via drill 0.35)  (2 unrouted)
  Top 0.152: J4.1
  Top 0.254: 39.65,20.48 J4.1 | 16.73,20.55 9.36,20.55 J1.1 | U5.2 55.91,29.68 v55.88,29.65 | v48.96,22.35 48.96,21.98 J6.1 J5.1 | J4.1 J3.1 J2.1
  Bottom 0.254: v55.88,29.65 54.02,27.79 54.02,27.11 52.07,25.16 52.07,23.43 50.99,22.35 49.27,22.35 v48.96,22.35
!RESET
  Top 0.152: 65.68,19.5 C14.1 65.67,19.99 | 67.14,21.46 67.14,21.63 R22.1
  Top 0.254: U5.34 66.83,29.18 67.12,28.89 67.12,26.22 68.83,24.51 68.83,21.39 SW3.B1 | SW3.B2 SW3.B1 | SW3.B1 67.82,21 R22.1 | CN10.5 66.14,14.99 70.68,14.99 71.31,15.62 71.31,17.4 70.64,18.07 67.67,18.07 66.88,18.86 66.31,18.86 65.67,19.49 C14.1 | 67.14,21.46 65.67,19.99
+3V3  (via drill 0.35, 0.6)
  Top 0.152: 61.62,25.55 61.62,25.52 61.6,25.52 v61.6,25.52 v61.59,25.53 | 51.37,14.5 51.37,16.82 | 72.38,16.74 CN10.1
  Top 0.254: CN8.2 8.55,7.94 42.35,7.94 v44.45,10.03 | 60.34,23.52 U5.16 60.34,20.47 60.07,20.19 C17.1 54.12,20.2 51.37,17.46 51.37,16.82 51.37,14.48 50.1,13.21 v49.02,13.21 | 63.33,32.66 63.04,32.95 62.15,32.95 61.86,32.66 61.86,31.87 U5.42 | 63.33,32.66 63.33,31.87 U5.39 63.34,32.62 | 63.33,32.66 63.62,32.96 64.71,32.96 65.47,32.19 65.47,31.76 C18.1 65.48,31.56 64.66,30.73 63.65,30.73 63.12,30.2 63.12,27.05 61.62,25.55 | C16.1 64.19,20.8 65.04,21.65 R22.2 65.67,22.29 67.44,24.06 67.45,24.06 | 67.45,24.06 67.45,24.07 67.45,25.08 66.85,25.68 U5.27 | 67.45,24.06 63.71,24.06 62.25,25.52 61.62,25.52 | 72.38,16.74 72.38,15.88 71,14.5 51.37,14.5
  Bottom 0.152: 48.5,16 C11.1 | 72.41,16.75 CN10.1 | v61.59,25.53
  Bottom 0.254: C11.1 49.02,15.23 v49.02,13.21 49.02,13.17 U1.2 47.17,11.31 D2.A v44.45,10.03 | IC1.1 73.92,2.87 | U6.2 72.72,1.78 73.92,2.98 IC1.1 | 72.41,16.75 73.92,15.24 IC1.1 | 48.5,16 48.5,17.71 53.41,22.63 58.69,22.63 v61.59,25.53
+5V  (via drill 0.3, 0.35, 0.6)
  Top 0.152: 33.04,32.56 L2.2 | 71.81,24.22 LED1.A | RPLP.1 44.75,35.17 | 44.75,33.79 RTOP.1
  Top 0.254: 44.75,35.17 44.75,33.79 | COUT1.1 73.23,24.13 LED1.A | 71.81,24.22 v71.03,24.99 | v25.02,18.41 24.19,17.59 9.14,17.59 6.73,15.18 CN8.1 | v54.71,27.04 54.71,27.48 52.78,29.41 COUT2.1 49.47,29.41 49.41,29.35 49.37,29.38 | RTOP.1 47.39,33.78 48.42,32.75 48.42,30.33 49.37,29.38 | L2.2 33.03,30.42 34.68,28.77 48.76,28.77 49.37,29.38
  Top 0.381: v46.99,13.34 46.99,5.08 50.1,1.97 61.02,1.97 61.91,2.86 D3.K
  Bottom 0.152: CN8.1 | v71.03,24.99 v71.02,25
  Bottom 0.254: 26.62,18.38 26.59,18.41 | 38.8,12.01 38.8,11.94 | v71.02,25 66.6,25 65.47,26.13 65.47,26.16 56.58,26.16 53.47,23.05 52.96,23.05 52.58,23.05 52.58,24.89 54.71,27.02 v54.71,27.04 | v25.03,18.41 v25.02,18.41
  Bottom 0.381: v46.99,13.34 U1.3 44.97,13.34 D2.K 43.57,11.94 38.8,11.94 33.83,11.94 | 26.62,18.38 30.5,14.5 33.06,11.94 33.83,11.94 | 33.83,11.94 C13.1 | R8.2 38.8,12.01 | 52.58,23.05 51.18,21.65 29.84,21.65 26.59,18.41 v25.03,18.41
  pour Bottom (rank 4): 44.45,12.19 45.97,12.19 45.97,14.61 43.5,14.61 43.43,12.19 43.5,12.64
CAN0_RD  (via drill 0.35)
  Top 0.254: IC3.4 v54.29,11.62 | v61.59,24.64 61.62,24.61 62.03,24.61 62.84,23.79 U5.21
  Bottom 0.254: v54.29,11.62 54.29,11.65 53.49,12.45 53.49,17.11 56.7,20.32 57.08,20.32 61.4,24.64 v61.59,24.64
CAN0_TD  (via drill 0.35)
  Top 0.254: IC3.1 v54.29,7.81 | v57.21,21.97 58.25,23.01 U5.13
  Bottom 0.254: v54.29,7.81 54.26,7.81 53.05,9.02 53.05,17.81 v57.21,21.97
CANH
  Top 0.152: 49.01,9.08 49.02,9.09
  Top 0.254: 49.02,9.09 48,10.1 48,15 46.5,16.5 46.5,17.6 50.09,21.19 50.09,22.11 49.21,22.99 J6.2 J5.2 J4.2 J3.2 J2.2 J1.2 | 49.01,9.08 IC3.7
  Bottom 0.254: J6.2 49.81,22.99 50.27,23.44 R15.2 | J1.2 8.03,22.99 7.46,23.55 6.49,23.55 R16.1
CANL  (via drill 0.3)
  Top 0.254: IC3.6 51.61,10.35 52,10.74 52,12.18 v51.68,12.5 | v50.5,18.71 v50.5,18.72 50.5,24.46 49.47,25.49 J6.3 J5.3 J4.3 J3.3 J2.3 J1.3
  Bottom 0.254: v51.68,12.5 51.68,12.69 51.68,16.83 50.5,18.02 v50.5,18.71 | R15.1 50.23,24.94 49.69,25.49 J6.3 | J1.3 7.9,25.49 7.53,25.11 6.52,25.11 R16.2
D+
  Top 0.254: U5.35 66.04,29.66 66.92,29.66 67.68,28.91 67.68,26.52 69.68,24.52 69.68,22.28 70.1,21.85 73.21,21.85 73.54,21.52 73.54,15.81 68.29,10.57 68.29,6.57 68.9,5.97 GND.3
D-
  Top 0.254: GND.2 69.9,5.19 71.53,5.19 72.01,5.67 72.01,8.06 71.69,8.38 70.23,8.38 69.88,8.73 69.88,11.07 74.36,15.55 74.36,30.22 73.34,31.23 68.71,31.24 67.44,32.51 66.48,32.51 66.15,32.17 66.15,30.37 U5.36
DETECT  (via drill 0.35)
  Top 0.254: 0.7,24 0.92,24.23 | 0.92,24.23 4.19,27.5 48.07,27.5 50.74,24.83 53.53,24.83 v54.29,24.83 | U5.48 58.67,31.97 57.42,31.97 56.71,31.26 v56.71,31.24 | 0.92,24.23 0.67,23.97 0.67,13.32 CN8.3
  Bottom 0.254: v54.29,24.83 56.71,27.24 v56.71,31.24
GND  (via drill 0.35, 0.6)  (61 unrouted)
  Top 0.152: R2.2 39.5,41.5 39.5,41.35
  Top 0.254: C12.2 R12.2 59.35,13.01 58.12,11.78 58.12,10.05 v58.1,10.03 | C16.2 62.69,20.32 62.34,20.66 U5.20 | C16.2 62.69,19.67 | 73.27,22.67 COUT1.2 71.92,22.68 R13.1 | U5.40 U5.41 62.36,31.84 v62.36,27.88 | C17.2 54.74,23.69 56.23,25.18 U5.11 | C1.2 55.93,1.22 v56.01,1.14 | GND.S2 73.54,1.77 v73.98,1.33 | 72.84,19 SW3.A2 | C16.2 62.69,19.79 | v58.1,7.05 | IC3.2 57.66,9.08 v58.1,8.64 | IC2.14 38.94,32.37 38.52,32.37 38.36,32.21 38.36,31.79 38.22,31.65 D5.2 36.44,31.65 COUT3.2 | IC2.16 39.02,30.52 39.5,30.04 41.03,30.04 41.26,30.27 IC2.4 | CBP1.2 CBP2.2 | RBOT.2 CBP2.2 | COUT2.2 COUT5.2 49.59,32.4 47.94,34.05 v47.94,34.92 | C14.2 67.98,19 SW3.A1 | CBP2.2 46.16,30.99 v46.67,30.48
  Bottom 0.152: 66.34,10.52 U6.GND
  Bottom 0.254: U2.2 43.2,15.26 43.93,15.99 C10.2 | 67.42,27.94 Y1.2 62.42,27.94 v62.36,27.88 | 67.42,27.94 68.01,27.36 C3.2 | C2.2 68.01,28.52 | 68.01,28.52 68.07,28.59 68.35,28.3 CN1.N | 68.01,28.52 67.46,27.97 67.42,27.94 | IC1.8 IC1.9 | v58.1,7.05 58.1,6.36 56.32,4.57 U6.15 55.99,1.16 v56.01,1.14 | IC1.18 73.92,19.36 U6.38 | 48.83,33.15 D4.A 51.23,31.58 50.5,30.85 Q1.2 | 48.83,33.15 48.07,32.38 v47.62,32.38 | v47.94,34.92 47.94,34.04 48.83,33.15
  other vias: 61.02,7.05 59.56,7.05 59.44,17.84 59.18,25.02 64.01,25.02 57.72,31.24 71.37,5.97 72.64,5.97 55.44,23.37 56.45,23.37 47.62,31.43 47.62,30.48 46.67,31.43 34.29,30.48 37.15,30.48
  pour Top (rank 6): -0.64,50.8 75.56,50.8 75.56,-0.64 -0.64,-0.64
  pour Bottom (rank 6): -1.84,52.07 76.83,52.07 76.83,-1.91 -1.84,-1.91
KICKER  (via drill 0.35)
  other vias: 7.05,36.45 6.16,36.45 5.27,36.45 4.38,36.45 4.38,35.43 5.27,35.43 6.16,35.43 7.05,35.43
  pour Top: 7.3,43.18 7.87,42.61 7.87,33.97 7.43,33.53 2.6,33.53 2.54,33.59 0.7,35.43 0.7,42.16 0.7,42.61 1.27,43.18
  pour Bottom: 1.27,43.18 7.3,43.18 7.87,42.61 7.87,33.97 7.43,33.53 2.67,33.53 0.7,35.5 0.7,42.61
LSW1  (via drill 0.35)
  Top 0.254: U5.7 57.15,27.2 55.67,27.2 51.18,31.69 51.18,35.14 50.06,36.26 48.58,36.26 48.32,36.51 48.01,36.51 40.85,36.52 39.59,37.78 v38.73,37.78
  Bottom 0.254: U4.1 39.1,38.15 v38.73,37.78
LSW2  (via drill 0.35)
  Top 0.254: v28.26,37.78 27.28,37.78 24.55,35.05 24.55,30.61 26.84,28.32 48.45,28.32 50.72,26.05 55.39,26.05 56.03,26.68 U5.8
  Bottom 0.254: U7.1 28.63,38.15 v28.26,37.78
LSW3  (via drill 0.35)
  Top 0.254: v17.78,37.78 17.78,30.54 20.42,27.9 48.24,27.9 50.66,25.48 55.52,25.48 56.22,26.18 U5.9
  Bottom 0.254: U8.1 18.15,38.15 v17.78,37.78
N$1
  Bottom 0.152: Q1.3
  Bottom 1.016: Q1.3 41.94,34.94 44,37.51 CN2.N
  pour Bottom: 41.21,42.93 40.64,42.35 40.64,37.91 40.64,37.4 39.62,36.39 38.67,35.43 38.67,30.8 39.31,30.16 44.64,30.16 46.86,32.38 46.86,42.35 46.29,42.93
N$2  (via drill 0.3)
  Top 0.152: v38.54,44.63 38.54,43.55 R1.2
  Bottom 0.152: v38.54,44.63 37.26,44.63 U4.3
N$3  (via drill 0.3)
  Top 0.152: v49.79,34.63 v49.78,34.63 COUT5.1
  Top 0.254: R1.1 R2.1 38.43,40.7 40.01,40.7 40.44,40.27 40.44,37.82 41.27,36.99 v48.82,36.99
  Bottom 0.152: Q1.1 49.79,35.35 v49.79,34.63
  Bottom 0.254: v48.82,36.99 48.9,36.99 49.74,36.15 Q1.1
N$5
  Bottom 1.016: CN3.N 33.52,37.94 28.73,33.15 Q2.3
  pour Bottom: 30.67,42.8 30.16,42.29 30.16,37.59 28.89,36.32 25.72,36.32 24.77,35.37 24.77,30.86 25.46,30.16 32.51,30.16 34.67,32.32 34.67,35.88 36.51,37.72 36.51,42.35 36.07,42.8
N$6  (via drill 0.3)
  Top 0.152: R3.1 38.22,39.45 v38.22,38.87
  Bottom 0.152: U4.2 37.21,38.34 37.34,38.47 37.82,38.47 v38.22,38.87
N$7  (via drill 0.3)
  Top 0.152: v27.73,38.87 27.73,39.63 27.42,39.94 R6.1
  Bottom 0.152: v27.73,38.87 26.91,38.06 26.83,38.06 U7.2
N$8  (via drill 0.3)  (1 unrouted)
  Top 0.152: v28.17,44.5 28.17,43.44 R4.1
  Bottom 0.152: v28.17,44.5 27.67,45 26.73,45
N$9
  Bottom 1.016: CN4.N 23.05,39.23 16.96,33.15 Q3.3
  pour Bottom: 12.64,36.51 12.13,36 12.13,30.48 12.45,30.16 19.62,30.16 21.65,32.19 21.65,35.88 22.54,36.77 25.91,36.77 26.16,37.02 26.16,42.29 25.53,42.93 21.91,42.93 20.26,41.27 20.26,38.1 18.67,36.51
N$10
  pour Bottom (isolate 0.254, rank 4): 66.17,31.43 74.17,31.43 74.17,37.15 63.94,37.15 63.94,33.66
N$13
  Top 0.254: LED9.A D3.A | C12.1 61.91,11.44 D3.A | D3.A 62.87,9.13 62.87,5.71 64.21,4.37 GND.1
N$16
  Top 0.152: 40.49,32.19 IC2.17 | 26.53,33.06 L2.1 | 39,33 IC2.13 39,33
  Top 0.254: D5.1 37.35,34.6 37.35,33.9 | 37.35,33.9 37.35,35.12 CBST.1 39.01,35.1 39.01,34.52 39.01,34.44 | 39.01,34.44 IC2.12 39.77,33.12 40.51,32.37 IC2.17 | IC2.13 39.01,34.44 | L2.1 26.53,33.39 27.56,34.42 33.91,34.42 35.18,33.15 36.66,33.15 37.35,33.83 37.35,33.9 | IC2.1 39.76,31.47 40.49,32.19
N$17  (via drill 0.35)
  Top 0.254: U5.32 64.47,28.18 v64.01,28.64
  Bottom 0.254: C2.1 67.05,30.15 Y1.1 64.51,29.14 v64.01,28.64
N$18
  Top 0.254: R12.1 59.56,10.74 59.56,9.35 LED9.K
N$19  (via drill 0.3)
  Top 0.152: 35.69,34.59 v35.71,34.57
  Top 0.254: R4.2 R5.1 28.02,40.64 29.46,40.64 30.02,40.08 30.02,37.19 30.53,36.68 34.88,36.68 35.69,35.88 35.69,34.59 | COUT3.1 35.71,33.92 v35.71,34.57
  Bottom 0.254: Q2.1 v35.71,34.57
N$20
  Top 0.254: R13.2 LED1.K
N$21
  Top 0.152: RBOT.1
  Top 0.254: RBOT.1 43.25,32.14 42.55,31.44 42.02,31.44 IC2.5
N$22
  Top 0.152: 42,33 IC2.8 | RTOP.2 43.25,33.79 | 43.25,35.17 RPLP.2
  Top 0.254: 42,33 42.54,33 RTOP.2 | 43.25,33.79 43.25,35.17
N$23
  Top 0.254: C1.1 53.34,9.08 54.61,10.35 55.98,10.35 IC3.3
N$24
  Top 0.254: IC2.10 40.76,34.85 CBST.2
N$25  (via drill 0.3)
  Top 0.152: R14.1 16.74,40.01 16.74,39.95 17.44,39.25 v17.44,38.94
  Bottom 0.152: U8.2 16.24,38.18 17,38.18 17.44,38.62 v17.44,38.94
N$26  (via drill 0.3)
  Top 0.152: v16.99,44.7 18.28,43.41 R7.1
  Bottom 0.152: U8.3 16.29,44.69 v16.98,44.69 v16.99,44.7
N$27  (via drill 0.35)
  Top 0.254: U5.31 64.45,27.68 v64.01,27.24
  Bottom 0.152: Y1.3
  Bottom 0.254: C3.1 67.11,25.67 Y1.3 64.51,26.74 v64.01,27.24
N$28  (via drill 0.3)
  Top 0.152: 22.33,34.43 v22.6,34.43
  Top 0.254: COUT4.1 22.18,34.43 v22.6,34.43 22.6,35.58 19.41,38.77 19.41,40.14 18.87,40.68 17.49,40.68 R11.1 R7.2
  Bottom 0.152: v22.6,34.43 22.69,34.52 Q3.1
STBY  (via drill 0.35)
  Top 0.254: U5.4 55.92,28.68 v55.88,28.64 | v53.21,23.69 53.21,22.42 52.39,21.59 v52.39,20.38 | v52.39,9.08 52.39,8.45 51.75,7.81 IC3.8
  Bottom 0.254: v52.39,20.38 52.39,9.34 52.39,9.33 v52.39,9.08 | v55.88,28.64 55.88,27.37 53.21,24.7 v53.21,23.69
V+  (via drill 0.3, 0.35, 0.6)  (2 unrouted)
  Top 0.152: 44,31.5 43.93,31.43 | F1.1 8.15,31.01 v8.15,29.45
  Top 0.254: CBP1.1 CBP2.1 43.93,31.43 | IC2.2 IC2.3 | F2.1 F1.1 | IC2.11 40.26,34.16 39.75,34.67 39.75,35.62 40.01,35.88 44.06,35.88 44.06,35.87 | 44,31.5 44,35.88 v47.94,35.88
  Bottom 0.152: D4.K 50.91,28.23 9.37,28.23 v8.15,29.45
  Bottom 0.254: C19.1 52.5,37.85 48.7,37.85 47.94,37.08 v47.94,35.88
  other vias: 10.41,16.76 10.41,15.49 10.41,14.22 10.41,12.95 10.41,11.68 10.41,10.41 11.94,10.41 11.94,11.68 11.94,12.95 11.94,14.22 11.94,15.49 11.94,16.76 17.27,16.76 18.54,16.76 18.54,15.49 17.27,15.49 17.27,14.22 18.54,14.22 18.54,12.95 17.27,12.95 17.27,11.68 18.54,11.68 17.27,10.41 18.54,10.41 24.64,16.76 25.91,16.76 24.64,15.49 25.91,15.49 24.64,14.22 25.91,14.22 24.64,12.95 25.91,12.95 24.64,11.68 25.91,11.68 24.64,10.41 25.91,10.41 35.31,15.49 38.73,16.64 36.45,16.64 39.88,16.64 36.45,15.49 35.31,16.64 41.02,16.64 42.16,16.64 43.31,16.64 37.59,16.64 37.59,15.49 6.22,29.46 6.22,28.57 7.24,29.46 7.24,28.57 9.08,28.57 9.08,29.46 10.1,28.57 10.1,29.46
  pour Top (isolate 0.406, rank 5): 53.28,37.15 61.34,37.15 61.34,32.89 61.28,32.83 57.83,32.83 55.44,30.67 54.1,30.67 53.28,31.5
  pour Top (isolate 0.406, rank 4): 9.78,8.7 42.35,8.7 43.69,10.03 43.69,17.27 9.78,17.27
  pour Bottom (isolate 0.406, rank 5): 53.22,37.15 61.34,37.15 61.34,32.38 61.02,32.07 56.96,32.07 52.33,27.43 6.86,27.43 5.84,26.42 5.84,23.81 7.81,21.84 7.81,20.38 10.92,17.27 43.69,17.27 43.69,10.03 42.35,8.7 6.79,8.7 6.79,14.16 0.44,20.51 0.44,27.18 1.4,28.13 4.45,28.13 5.27,28.96 5.27,29.27 5.97,29.97 10.41,29.97 10.92,29.46 50.36,29.46 53.28,32.38
  pour Top: 5.97,31.75 10.29,31.75 10.73,31.31 10.73,28.45 10.41,28.13 5.97,28.13 5.59,28.51 5.59,31.37
VMOTOR  (via drill 0.35)
  other vias: 9.21,37.47 10.1,37.47 9.21,36.45 10.1,36.45 10.99,36.45 9.21,35.43 10.1,35.43 10.99,35.43
  pour Top (isolate 0.406, rank 4): 8.45,33.97 8.45,42.61 9.02,43.18 15.18,43.18 15.75,42.61 15.75,38.67 10.6,33.53 8.89,33.53
  pour Top (isolate 0.406, rank 5): 18.99,49.66 47.5,49.66 47.5,43.18 18.99,43.18
  pour Bottom (isolate 0.406, rank 5): 18.54,49.66 47.5,49.66 47.5,43.18 21.97,43.18 18.22,39.43 16.51,39.43 14.03,36.96 12.51,36.96 11.87,36.32 11.87,34.8 10.6,33.53 8.83,33.53 8.45,33.91 8.45,42.61 9.02,43.18 15.24,43.18 15.62,43.56 16.76,43.56 17.72,44.51 17.72,48.83
VOLT_BAT  (via drill 0.35)
  Top 0.254: U5.1 58.98,30.24 v58.99,30.23
  Bottom 0.254: R9.1 60.52,30.23 | 60.52,30.23 R10.2 | v58.99,30.23 60.52,30.23
VREF  (via drill 0.6)
  Top 0.254: 58.23,24.19 58.23,23.94 55.24,20.95 53.98,20.95 50.04,17.02 v47.24,17.02 | 58.23,24.19 58.23,25.51 58.06,25.68 U5.10 | U5.14 59.34,23.97 59.12,24.19 58.23,24.19
  Bottom 0.254: v47.24,17.02 46.74,17.02 44.96,15.24 43.94,15.24 43.69,14.99 43.69,14.35 43.43,14.1 42.42,14.1 41.9,14.62 U2.1 41.53,15.36 R8.1
XBEE_RX
  Top 0.254: U5.19 61.84,19.24 62.75,18.34 66.82,18.34 67.5,17.65 68.77,17.65 69.67,16.75 CN10.2
  Bottom 0.254: CN10.2 70.18,16.94 U6.35 70.15,19.32 70.15,21.88 69.39,22.64 64.13,22.64 63.42,21.93 63.42,21.66 IC1.11
XBEE_TX
  Top 0.254: U5.18 61.34,18.86 62.42,17.78 66.64,17.78 67.67,16.75 CN10.3
  Bottom 0.254: CN10.3 68.91,17.29 U6.34 68.65,19.55 68.65,21.82 68.24,22.23 65.29,22.23 64.92,21.87 IC1.12